# Altium project BLE_fan_pcb.PrjPcb
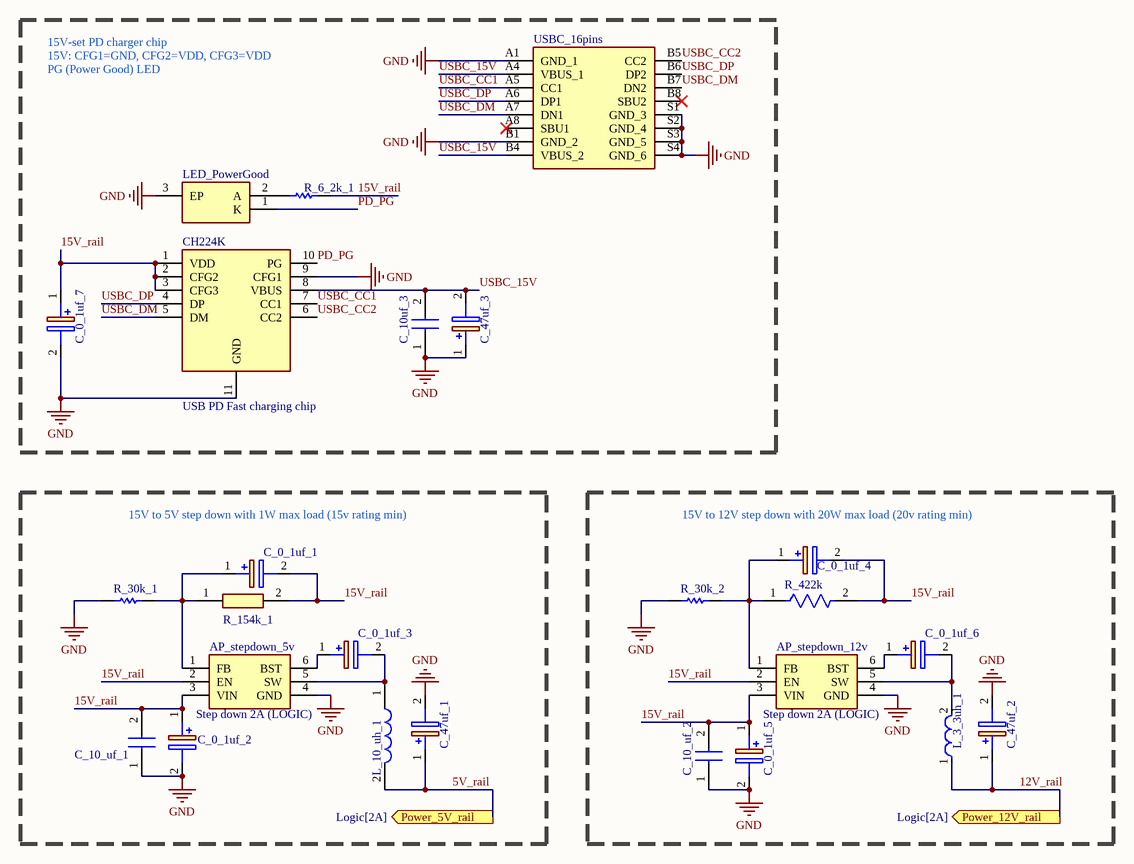
[diagram p0: Power_lines.SchDoc]
2 sheets, 38 parts. Net scope: flat (ports and power ports of the same name join across sheets).
Board file: Power_ESP32_board.PcbDoc
Sheets:
  Power_lines.SchDoc
  Logic.SchDoc

## Sheet Power_lines.SchDoc
size A4; SheetNumber: 1; SheetTotal: 2

### Parts
AP_stepdown_5v  Step down 2A (LOGIC)  [SOT95P280X100-6N]
AP_stepdown_12v  Step down 2A (LOGIC)  [SOT95P280X100-6N]
C_0_1uf_1  TAJS104K020RNJ  [CAPPM3216X120N]  (value not drawn)
C_0_1uf_2  TAJS104K020RNJ  [CAPPM3216X120N]  (value not drawn)
C_0_1uf_3  TAJS104K020RNJ  [CAPPM3216X120N]  (value not drawn)
C_0_1uf_4  TAJS104K020RNJ  [CAPPM3216X120N]  (value not drawn)
C_0_1uf_5  TAJS104K020RNJ  [CAPPM3216X120N]  (value not drawn)
C_0_1uf_6  TAJS104K020RNJ  [CAPPM3216X120N]  (value not drawn)
C_0_1uf_7  TAJS104K020RNJ  [CAPPM3216X120N]  (value not drawn)
C_10_uf_1  CL31B106KAHNFNE  [CAPC3216X180N]  (value not drawn)
C_10_uf_2  CL31B106KAHNFNE  [CAPC3216X180N]  (value not drawn)
C_10uf_3  CL31B106KAHNFNE  [CAPC3216X180N]  (value not drawn)
C_47uf_1  TAJC476K020SNJ  [CAPPM6032X280N]  (value not drawn)
C_47uf_2  TAJC476K020SNJ  [CAPPM6032X280N]  (value not drawn)
C_47uf_3  TAJC476K020SNJ  [CAPPM6032X280N]  (value not drawn)
CH224K  USB PD Fast charging chip  [SOP100P600X180-11N]
L_3_3uh_1  LQH5BPN3R3N38K  [FP-LQH5BPN_38-MFG]  (value not drawn)
L_10_uh_1  SRR1260-100M  [SRR1260100M]  (value not drawn)
LED_PowerGood  IN-S126ASA  [INS126ASA]  (value not drawn)
R_6_2k_1  6K2 5% 2512(6432)  [RESC2512(6432)_L]  (value not drawn)
R_30k_1  30K 1% 2512(6432)  [RESC2512(6432)_M]  (value not drawn)
R_30k_2  30K 1% 2512(6432)  [RESC2512(6432)_M]  (value not drawn)
R_154k_1  ERJ-8ENF1543V  [ERJ8ENF1000V]  (value not drawn)
R_422k  CRCW2512422KFKEG  [FP-CRCW2512-e3-IPC_A]  (value not drawn)
USBC_16pins  USB4940-00-A  [USB494000A]  (value not drawn)

### Ports
Power_5V_rail (out, see Logic[2A]), Power_12V_rail (out, see Logic[2A])

### Nets
GND: AP_stepdown_5v.4(GND) AP_stepdown_12v.4(GND) C_0_1uf_2.2(-) C_0_1uf_5.2(-) C_0_1uf_7.2(-) C_10_uf_1.1 C_10_uf_2.1 C_10uf_3.1 C_47uf_1.2(-) C_47uf_2.2(-) C_47uf_3.1(+) CH224K.9(CFG1) CH224K.11(GND) LED_PowerGood.3(EP) R_30k_1.1 R_30k_2.1 USBC_16pins.A1(GND_1) USBC_16pins.B1(GND_2) USBC_16pins.S1(GND_3) USBC_16pins.S2(GND_4) USBC_16pins.S3(GND_5) USBC_16pins.S4(GND_6)
5V_rail: C_47uf_1.1(+) L_10_uh_1.2 ; port Power_5V_rail
12V_rail: C_47uf_2.1(+) L_3_3uh_1.1 ; port Power_12V_rail  [project net 12V]
15V_rail: AP_stepdown_5v.2(EN) AP_stepdown_5v.3(VIN) AP_stepdown_12v.2(EN) AP_stepdown_12v.3(VIN) C_0_1uf_1.2(-) C_0_1uf_2.1(+) C_0_1uf_4.2(-) C_0_1uf_5.1(+) C_0_1uf_7.1(+) C_10_uf_1.2 C_10_uf_2.2 CH224K.1(VDD) CH224K.2(CFG2) CH224K.3(CFG3) R_6_2k_1.2 R_154k_1.2 R_422k.2
PD_PG: CH224K.10(PG) LED_PowerGood.1(K)
USBC_15V: C_10uf_3.2 C_47uf_3.2(-) CH224K.8(VBUS) USBC_16pins.A4(VBUS_1) USBC_16pins.B4(VBUS_2)
USBC_CC1: CH224K.7(CC1) USBC_16pins.A5(CC1)
USBC_CC2: CH224K.6(CC2) USBC_16pins.B5(CC2)
USBC_DM: CH224K.5(DM) USBC_16pins.A7(DN1) USBC_16pins.B7(DN2)
USBC_DP: CH224K.4(DP) USBC_16pins.A6(DP1) USBC_16pins.B6(DP2)
NetAP_stepdown_5v_1: AP_stepdown_5v.1(FB) C_0_1uf_1.1(+) R_30k_1.2 R_154k_1.1
NetAP_stepdown_5v_5: AP_stepdown_5v.5(SW) C_0_1uf_3.2(-) L_10_uh_1.1
NetAP_stepdown_5v_6: AP_stepdown_5v.6(BST) C_0_1uf_3.1(+)
NetAP_stepdown_12v_1: AP_stepdown_12v.1(FB) C_0_1uf_4.1(+) R_30k_2.2 R_422k.1
NetAP_stepdown_12v_5: AP_stepdown_12v.5(SW) C_0_1uf_6.2(-) L_3_3uh_1.2
NetAP_stepdown_12v_6: AP_stepdown_12v.6(BST) C_0_1uf_6.1(+)
NetLED_PowerGood_2: LED_PowerGood.2(A) R_6_2k_1.1

Not connected (* = marked no-connect by the designer): USBC_16pins A8(SBU1)* B8(SBU2)*

### Notes on the sheet
- 15V-set PD charger chip
  15V: CFG1=GND, CFG2=VDD, CFG3=VDD
  PG (Power Good) LED
- 15V to 5V step down with 1W max load (15v rating min)
- (near C_0_1uf_4) 15V to 12V step down with 20W max load (20v rating min)

### Library data of the parts
AP_stepdown_5v AP_stepdown_12v = AP63201WU-7: Integrated Circuit; Manufacturer_Name: Diodes Incorporated; Datasheet Link: https://www.diodes.com//assets/Datasheets/AP63200-AP63201-AP63203-AP63205.pdf; Height: 1mm; Manufacturer_Part_Number: AP63201WU-7; Mouser Part Number: 621-AP63201WU-7; Mouser Price/Stock: https://www.mouser.co.uk/ProductDetail/Diodes-Incorporated/AP63201WU-7?qs=u16ybLDytRaVD%252BU3eG30NA%3D%3D; Arrow Part Number: AP63201WU-7; Arrow Price/Stock: https://www.arrow.com/en/products/ap63201wu-7/diodes-incorporated?utm_currency=USD&region=nac
C_0_1uf_1-C_0_1uf_7 = TAJS104K020RNJ: Capacitor Polarised; Manufacturer_Name: Kyocera AVX; Datasheet Link: http://datasheets.avx.com/TAJ.pdf; Height: 1.2mm; Manufacturer_Part_Number: TAJS104K020RNJ; Mouser Part Number: 581-TAJS104K020RNJ; Mouser Price/Stock: https://www.mouser.com/Search/Refine.aspx?Keyword=581-TAJS104K020RNJ; Arrow Part Number: TAJS104K020RNJ; Arrow Price/Stock: https://www.arrow.com/en/products/tajs104k020rnj/avx
C_10_uf_1 C_10_uf_2 C_10uf_3 = CL31B106KAHNFNE: Capacitor; Manufacturer_Name: SAMSUNG; Datasheet Link: http://product.samsungsem.com/mlcc/basic-search.do?partNumber=CL31B106KAHNFN; Height: 1.8mm; Manufacturer_Part_Number: CL31B106KAHNFNE; Mouser Part Number: 187-CL31B106KAHNFNE; Mouser Price/Stock: https://www.mouser.co.uk/ProductDetail/Samsung-Electro-Mechanics/CL31B106KAHNFNE?qs=xZ%2FP%252Ba9zWqbvZ%2FuLWvQDdQ%3D%3D; Arrow Part Number: CL31B106KAHNFNE; Arrow Price/Stock: https://www.arrow.com/en/products/cl31b106kahnfne/samsung-electro-mechanics?utm_currency=USD&region=europe
C_47uf_1-C_47uf_3 = TAJC476K020SNJ: Capacitor Polarised; Manufacturer_Name: Kyocera AVX; Datasheet Link: http://datasheets.avx.com/TAJ.pdf; Height: 2.8mm; Manufacturer_Part_Number: TAJC476K020SNJ; Mouser Part Number: 581-TAJC476K020SNJ; Mouser Price/Stock: https://www.mouser.co.uk/ProductDetail/AVX/TAJC476K020SNJ?qs=ZmOEJA1J3DLE5eMHI3FFQA%3D%3D; Arrow Part Number: TAJC476K020SNJ; Arrow Price/Stock: https://www.arrow.com/en/products/tajc476k020snj/avx?region=nac
CH224K = CH224K: Integrated Circuit; Manufacturer_Name: WCH; Datasheet Link: https://datasheet.lcsc.com/lcsc/2204251615_WCH-Jiangsu-Qin-Heng-CH224K_C970725.pdf; Height: 1.8mm; Manufacturer_Part_Number: CH224K
L_3_3uh_1 = CMP-06042-002276-1: Wire Wound Ferrite Inductor for Power Lines 3.3μH ±30% 0.0252Ω 4000mA 2020
L_10_uh_1 = SRR1260-100M: Inductor; Manufacturer_Name: Bourns; Datasheet Link: https://www.bourns.com/docs/Product-Datasheets/SRR1260.pdf; Height: 6.5mm; Manufacturer_Part_Number: SRR1260-100M; Mouser Part Number: 652-SRR1260-100M; Mouser Price/Stock: https://www.mouser.co.uk/ProductDetail/Bourns/SRR1260-100M?qs=%2FPiZ59IM4y0arRCchlmf7Q%3D%3D; Arrow Part Number: SRR1260-100M; Arrow Price/Stock: https://www.arrow.com/en/products/srr1260-100m/bourns?region=europe
LED_PowerGood = IN-S126ASA: LED; Manufacturer_Name: Inolux; Datasheet Link: https://www.inolux-corp.com/datasheet/SMDLED/Mono%20Color%20Side%20View/IN-S126AS%20Series_V1.0.pdf; Height: 1mm; Manufacturer_Part_Number: IN-S126ASA; Mouser Part Number: 743-IN-S126ASA; Mouser Price/Stock: https://www.mouser.co.uk/ProductDetail/Inolux/IN-S126ASA?qs=fAHHVMwC%252Bbj7z3FSP%252B%2FSIQ%3D%3D
R_6_2k_1 = CMP-1018-00093-1: 6K2 1W 5% 2512 (6432 Metric)  SMD; Value: 6200.00 Ohm; Case-Metric: 6432; Case-EIA: 2512; Tolerance: 5 %; Power: 1 W; Technology: SMT
R_30k_1 R_30k_2 = CMP-1018-00675-1: 30K 1W 1% 2512 (6432 Metric)  SMD; Case-EIA: 2512; Case-Metric: 6432; Value: 30000.00 Ohm; Technology: SMT; Power: 1 W; Tolerance: 1 %
R_154k_1 = ERJ-8ENF1543V: Resistor; Manufacturer_Name: Panasonic; Datasheet Link: https://industrial.panasonic.com/cdbs/www-data/pdf/RDA0000/AOA0000C86.pdf; Height: 0.7mm; Manufacturer_Part_Number: ERJ-8ENF1543V; Mouser Part Number: 667-ERJ-8ENF1543V; Mouser Price/Stock: https://www.mouser.co.uk/ProductDetail/Panasonic/ERJ-8ENF1543V?qs=JjxTDIFmKPRtPChynncWPw%3D%3D; Arrow Part Number: ERJ-8ENF1543V; Arrow Price/Stock: https://www.arrow.com/en/products/erj-8enf1543v/panasonic
R_422k = CMP-1018-00806-2: RES Thick Film, 422kΩ, 1%, 1W, 100ppm/°C, 2512; Resistance: 422kR; Voltage Rating (DC): 500V; Composition: Thick Film; Case Code (Metric): 6432; Tolerance: 1%; Min Operating Temperature: -55°C; Case/Package: 2512; Number of Terminations: 2; Height: 0.028inch; Length: 0.248inch; Max Operating Temperature: 155°C; Packaging: Cut Tape; Power Rating: 1W; Lead Free: Lead Free; Package Quantity: 10; Contact Plating: Tin; Case Code (Imperial): 2512; Features: Automotive AEC-Q200; Max Power Dissipation: 1W; Width: 0.124inch; Temperature Coefficient: 100ppm/°C
USBC_16pins = USB4940-00-A: Connector; Manufacturer_Name: GCT (GLOBAL CONNECTOR TECHNOLOGY); Datasheet Link: chrome-extension://efaidnbmnnnibpcajpcglclefindmkaj/https://lv.mouser.com/datasheet/3/1507/1/usb4940.pdf; Height: 3.46mm; Manufacturer_Part_Number: USB4940-00-A

## Sheet Logic.SchDoc
size A4; SheetNumber: 2; SheetTotal: 2
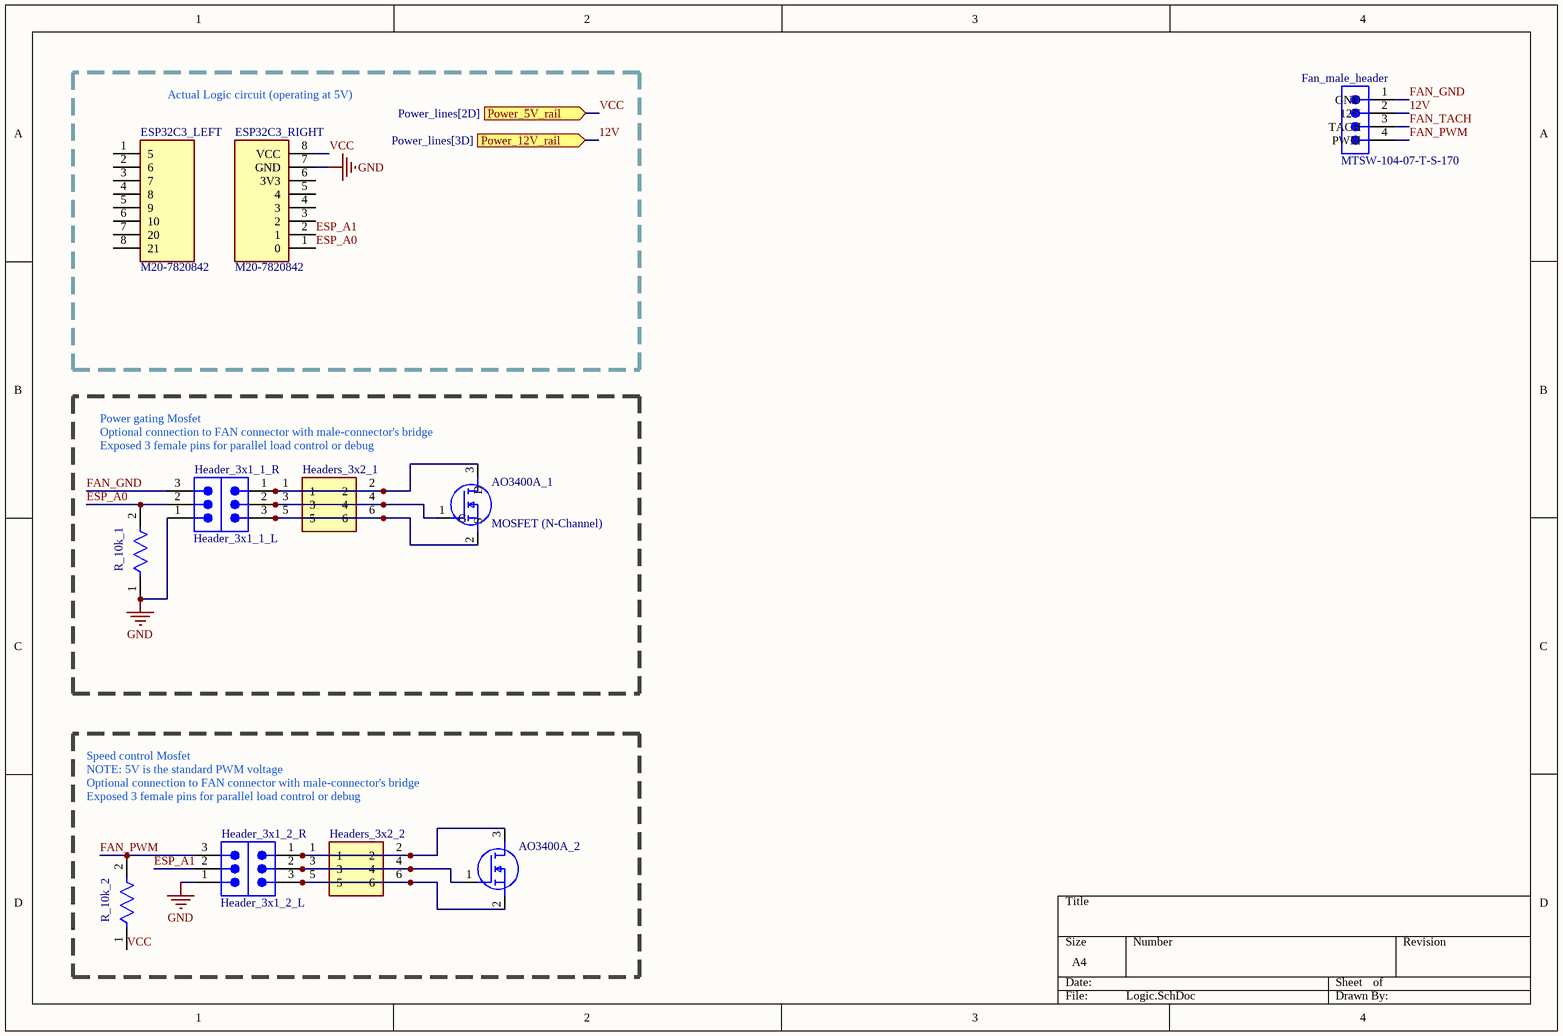
[diagram p1: Logic.SchDoc]

### Parts
AO3400A_1  MOSFET (N-Channel)  [SOT95P280X125-3N]
AO3400A_2  MOSFET (N-Channel)  [SOT95P280X125-3N]  (value not drawn)
ESP32C3_LEFT  M20-7820842  [RHDR8W80P0X254_1X8_2032X254X850P]
ESP32C3_RIGHT  M20-7820842  [RHDR8W80P0X254_1X8_2032X254X850P]
Fan_male_header  MTSW-104-07-T-S-170  [SMTC-MTSW-104-07-X-S-170]
Header_3x1_1_L  TSW-103-07-T-S  [SMTC-TSW-103-07-X-S]  (value not drawn)
Header_3x1_1_R  TSW-103-07-T-S  [SMTC-TSW-103-07-X-S]  (value not drawn)
Header_3x1_2_L  TSW-103-07-T-S  [SMTC-TSW-103-07-X-S]  (value not drawn)
Header_3x1_2_R  TSW-103-07-T-S  [SMTC-TSW-103-07-X-S]  (value not drawn)
Headers_3x2_1  Female header 3x2  [RHDR6W50P200X200_2X3_650X400X430P]  (value not drawn)
Headers_3x2_2  Female header 3x2  [RHDR6W50P200X200_2X3_650X400X430P]  (value not drawn)
R_10k_1  CRGCQ1206F10K  [FP-CRGCQ1206-IPC_C]  (value not drawn)
R_10k_2  CRGCQ1206F10K  [FP-CRGCQ1206-IPC_C]  (value not drawn)

### Ports
Power_5V_rail (in, see Power_lines[2D]), Power_12V_rail (in, see Power_lines[3D])

### Nets
GND: ESP32C3_RIGHT.7(GND) Header_3x1_1_L.1 Header_3x1_2_L.1 R_10k_1.1
12V: Fan_male_header.2(12V) ; port Power_12V_rail
ESP_A0: ESP32C3_RIGHT.1(0) Header_3x1_1_L.2 R_10k_1.2
ESP_A1: ESP32C3_RIGHT.2(1) Header_3x1_2_L.2
FAN_GND: Fan_male_header.1(GND) Header_3x1_1_L.3
FAN_PWM: Fan_male_header.4(PWM) Header_3x1_2_L.3 R_10k_2.2
FAN_TACH: Fan_male_header.3(TACH)
VCC: ESP32C3_RIGHT.8(VCC) R_10k_2.1 ; port Power_5V_rail  [project net 5V_rail]
NetAO3400A_1_1: AO3400A_1.1(G) Header_3x1_1_R.2 Headers_3x2_1.3 Headers_3x2_1.4
NetAO3400A_1_2: AO3400A_1.2(S) Header_3x1_1_R.3 Headers_3x2_1.5 Headers_3x2_1.6
NetAO3400A_1_3: AO3400A_1.3(D) Header_3x1_1_R.1 Headers_3x2_1.1 Headers_3x2_1.2
NetAO3400A_2_1: AO3400A_2.1(G) Header_3x1_2_R.2 Headers_3x2_2.3 Headers_3x2_2.4
NetAO3400A_2_2: AO3400A_2.2(S) Header_3x1_2_R.3 Headers_3x2_2.5 Headers_3x2_2.6
NetAO3400A_2_3: AO3400A_2.3(D) Header_3x1_2_R.1 Headers_3x2_2.1 Headers_3x2_2.2

Not connected (* = marked no-connect by the designer): ESP32C3_LEFT 1(5) 2(6) 3(7) 4(8) 5(9) 6(10) 7(20) 8(21); ESP32C3_RIGHT 3(2) 4(3) 5(4) 6(3V3)

### Notes on the sheet
- Actual Logic circuit (operating at 5V)
- Power gating Mosfet
  Optional connection to FAN connector with male-connector's bridge
  Exposed 3 female pins for parallel load control or debug
- Speed control Mosfet
  NOTE: 5V is the standard PWM voltage
  Optional connection to FAN connector with male-connector's bridge
  Exposed 3 female pins for parallel load control or debug

### Library data of the parts
AO3400A_1 AO3400A_2 = AO3400A: Manufacturer_Name: Alpha & Omega Semiconductors; Datasheet Link: http://aosmd.com/res/data_sheets/AO3400A.pdf; Height: 1.25mm; Manufacturer_Part_Number: AO3400A; Arrow Part Number: AO3400A; Arrow Price/Stock: https://www.arrow.com/en/products/ao3400a/alpha-and-omega-semiconductor?utm_currency=USD&region=nac
ESP32C3_LEFT ESP32C3_RIGHT = M20-7820842: Connector; Manufacturer_Name: Harwin; Datasheet Link: https://content.harwin.com/m/c2ac50ebb1c800d5/original/DRG-00385-Technical-Drawing-Datasheet-M20-782-pdf.pdf; Height: 8.5mm; Manufacturer_Part_Number: M20-7820842; Mouser Part Number: 855-M20-7820842; Mouser Price/Stock: https://www.mouser.co.uk/ProductDetail/Harwin/M20-7820842?qs=WS5Jv%252B%252Bx1qXOep0XOTvy2Q%3D%3D
Fan_male_header = CMP-1024-00105-1: Modified .025" SQ Post Header, Through-hole, Vertical, -55 to 105 degC, 2.54 mm Pitch, 4-Pin, Male, RoHS; Manufacturer: Samtec; Pitch: 2.54 mm; PartNumber: MTSW-104-07-T-S-170; ComponentLink3Description: Package Specification; ComponentLink2URL: http://www.samtec.com/documents/webfiles/pdf/MTSW.PDF; Temperature Range: -55 to 105 degC; DatasheetVersion: F-214; ComponentLink3URL: http://www.samtec.com/documents/webfiles/cpdf/MTSW-XXX-XX-X-X-XXXX-XX-XXX-MKT1.pdf; Orientation: Vertical; ComponentLink1URL: http://www.samtec.com; RoHS: True; PackageReference: MTSW-104-07-X-S-170; ComponentLink1Description: Manufacturer URL; Mounting Technology: Through-hole; PackageDescription: Assembly .025" [.64] SQ Post Terminal Strip; PackageVersion: BI, 2/1987; ComponentLink2Description: Datasheet
Header_3x1_1_L Header_3x1_1_R Header_3x1_2_L Header_3x1_2_R = CMP-1024-00332-1: 0.025" SQ Post Header, Through-hole, Vertical, -55 to 105 degC, 2.54 mm Pitch, 3-Pin, Male, RoHS; Manufacturer: Samtec; Pitch: 2.54 mm; ComponentLink1URL: http://www.samtec.com; ComponentLink3URL: http://www.samtec.com/documents/webfiles/cpdf/TSW-XXX-XX-XXX-X-XX-XXX-MKT.pdf; PartNumber: TSW-103-07-T-S; Mounting Technology: Through-hole; RoHS: True; DatasheetVersion: F-214; PackageVersion: DM, 8/1988; Temperature Range: -55 to 105 degC; ComponentLink2Description: Datasheet; ComponentLink1Description: Manufacturer URL; Orientation: Vertical; PackageReference: TSW-103-07-X-S; ComponentLink3Description: Package Specification; ComponentLink2URL: http://www.samtec.com/documents/webfiles/pdf/TSW_TH.PDF; PackageDescription: .025[0.64] SQ. Post Terminal Strip Assembly
Headers_3x2_1 Headers_3x2_2 = M22-7140342: Connector; Manufacturer_Name: Harwin; Datasheet Link: https://content.harwin.com/m/4af06443270d069b/original/DRG-00561-Technical-Drawing-Datasheet-M22-714-pdf.pdf; Height: 4.3mm; Manufacturer_Part_Number: M22-7140342; Mouser Part Number: 855-M22-7140342; Mouser Price/Stock: https://www.mouser.co.uk/ProductDetail/Harwin/M22-7140342?qs=93uzuGORGqdkFvC3%252BeKyAw%3D%3D
R_10k_1 R_10k_2 = CMP-03211-010884-1: CRGCQ1206 10KΩ 0.25W 1% ±100ppm/°C 200V; Manufacturer: TE Connectivity; Tolerance: 0.01; Automotive Grade: Grade 913; Value: 10KΩ; Automotive: Yes; Temperature: -55°C to +155°C; RoHS: TRUE; Series: CRGCQ; Lead Free: Yes; Device Class L3: Chip SMD Resistors; Package: CRGCQ1206; ComponentLink2URL: https://www.te.com/commerce/DocumentDelivery/DDEController?Action=showdoc&DocId=Data+Sheet%7F1773204-3%7F1%7Fpdf%7FEnglish%7FENG_DS_1773204-3_1.pdf%7F4-2176347-922; Ipc Land Pattern Name: RESC310155X55; Composition: Thick Film; Voltage Rating: 200V; Device Class L1: Passive Components; Temperature Range Low: -55°C; Resistance: 10KΩ; Height: 0.65mm; Power Rating: 0.25W; Device Class L2: Resistors; Temperature Range High: +155°C; Octopart: https://octopart.com/crgcq1206f10k-te+connectivity-91018244; Ambient Temperature Range High: +70°C; ComponentLink2Description: Datasheet; Temperature Coefficient: ±100ppm/°C; Manufacturer Part Number: CRGCQ1206F10K; Category: Res

## Nets that join several sheets
GND: Power_lines (22 pins), Logic (ESP32C3_RIGHT.7 Header_3x1_1_L.1 Header_3x1_2_L.1 R_10k_1.1)
5V_rail: Power_lines (C_47uf_1.1 L_10_uh_1.2), Logic (ESP32C3_RIGHT.8 R_10k_2.1)
12V: Power_lines (C_47uf_2.1 L_3_3uh_1.1), Logic (Fan_male_header.2)